# EasyEDA schematic SCH_Amiga-KickSmash-32-in-system-flash_2025-04-10.json

## Sheets
1 STM32: TITLE: STM32; REV: 7.1; Date: 2025-03-13; Sheet: 1/4; Drawn By: cdhooper; Company: eebugs.com
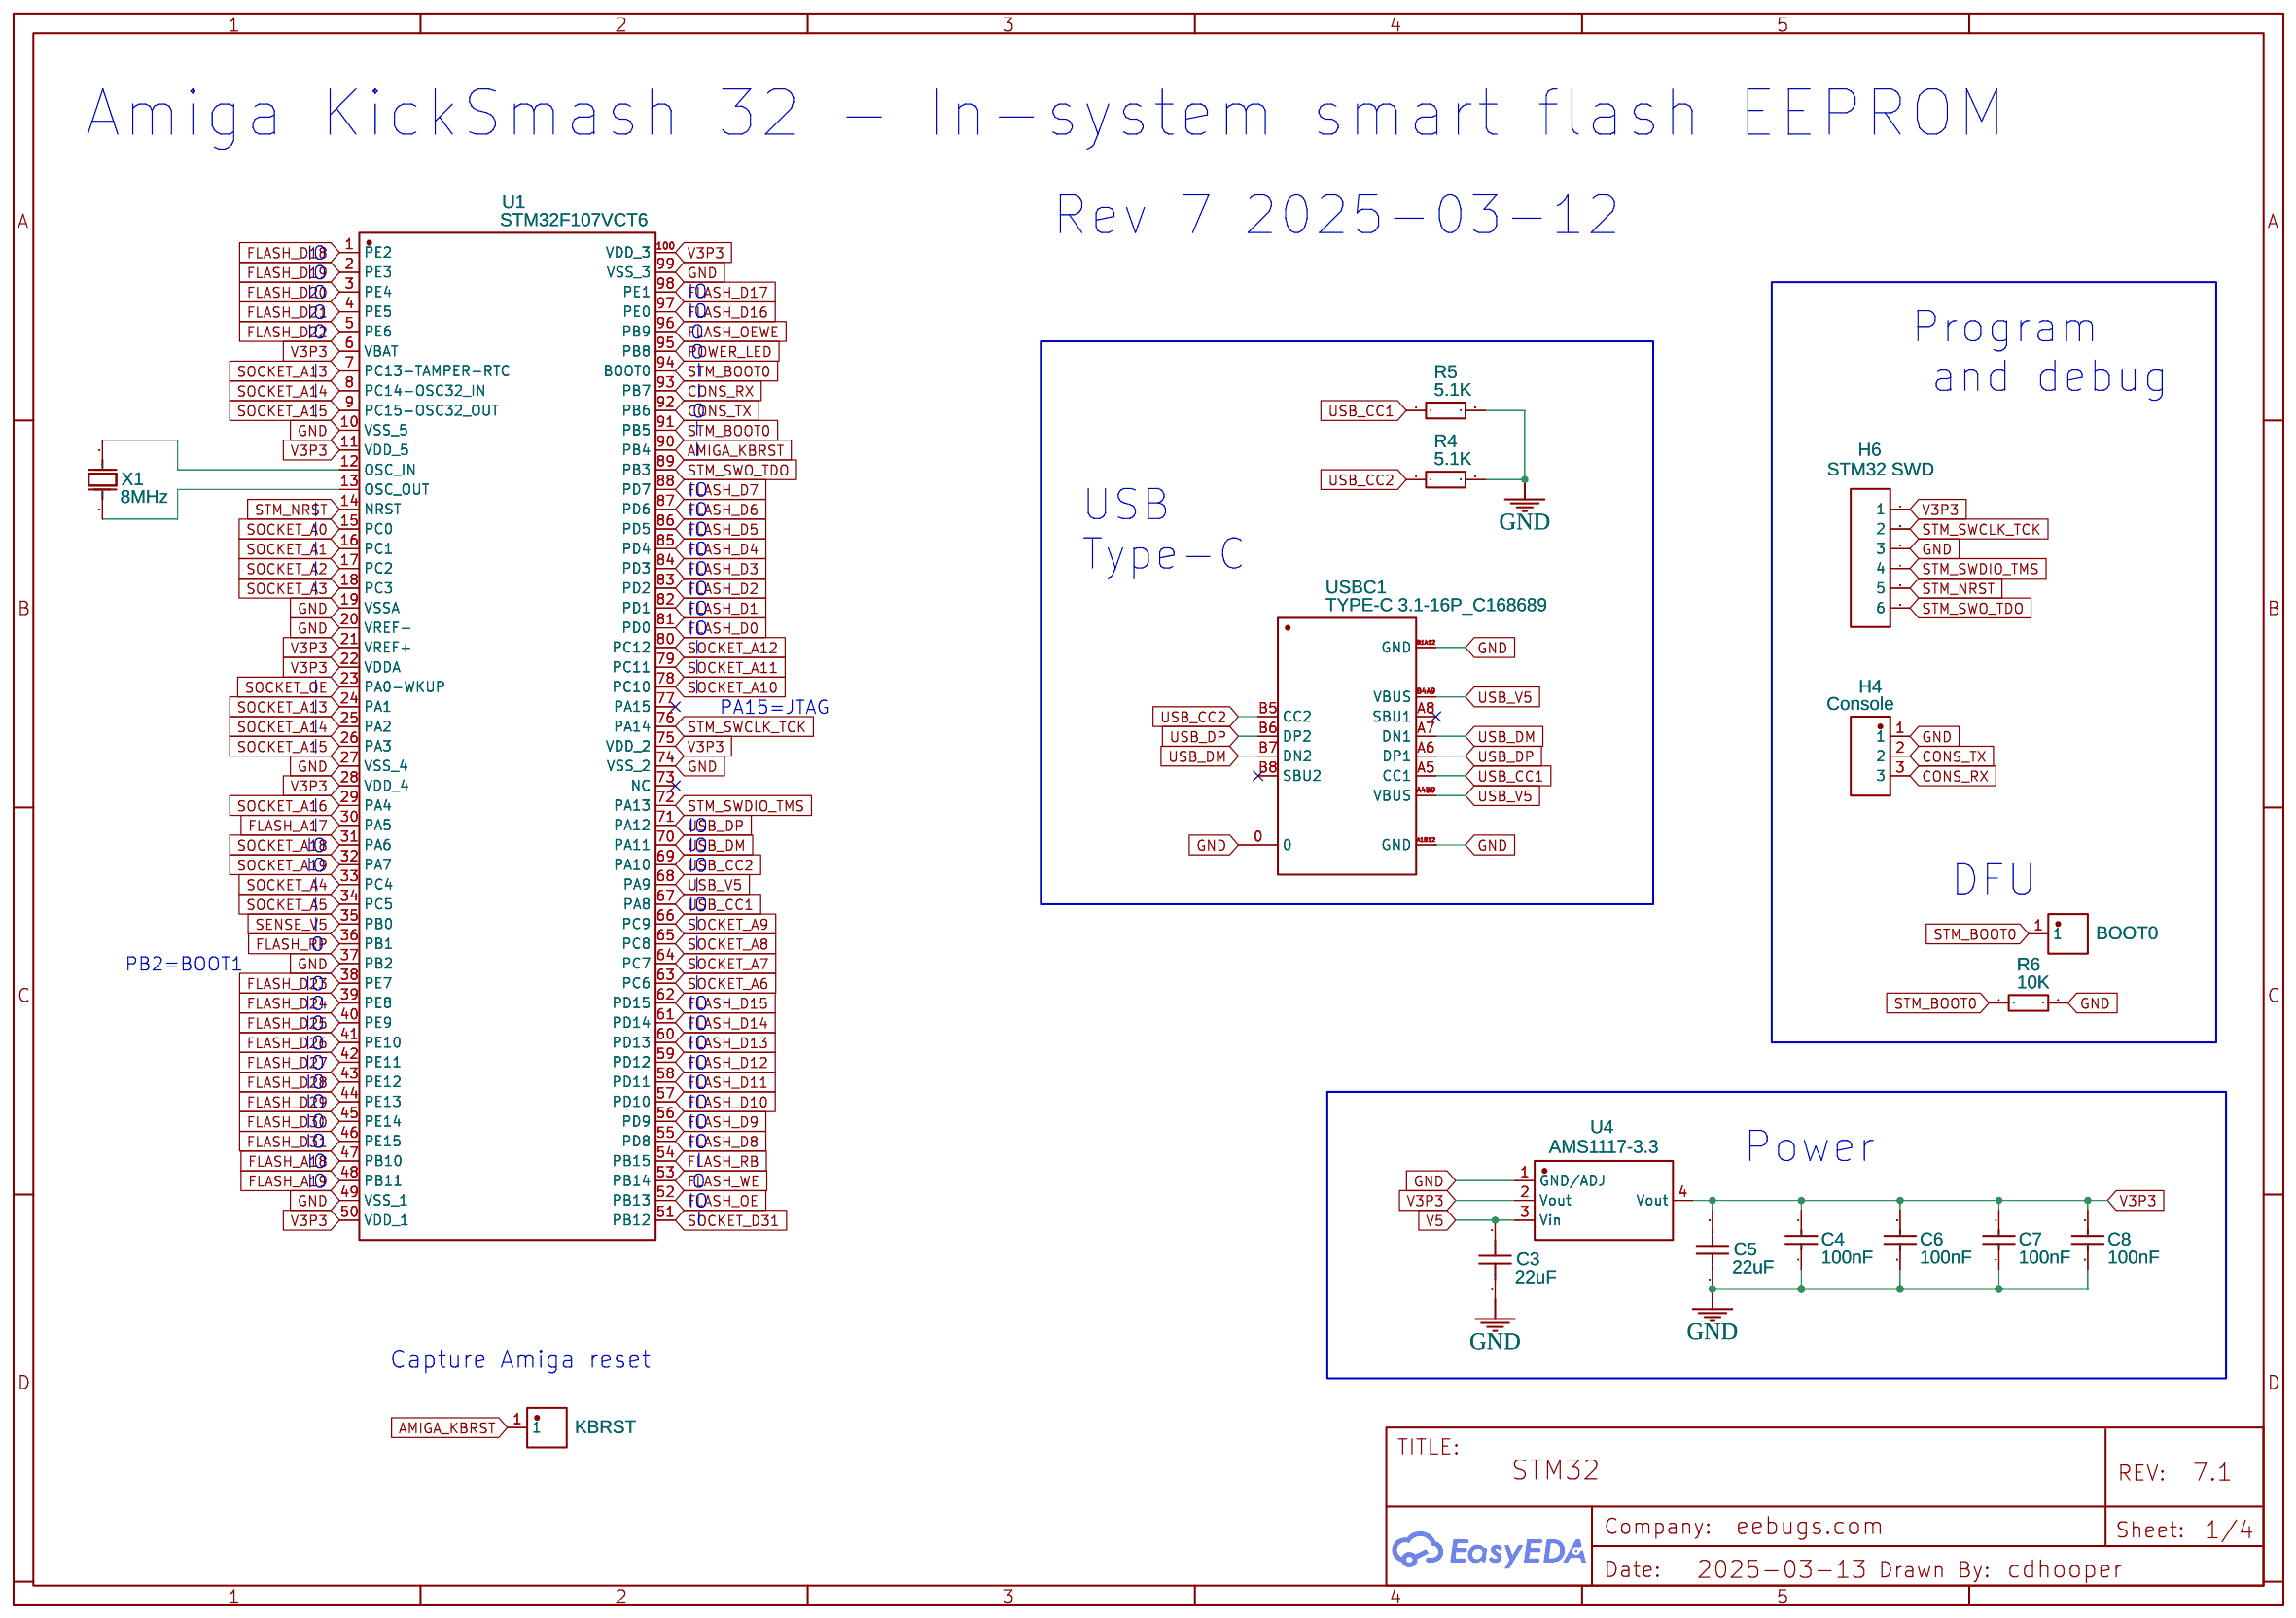
[diagram p0: STM32]
2 Flash: TITLE: Flash + Sockets; Sheet: 2/4
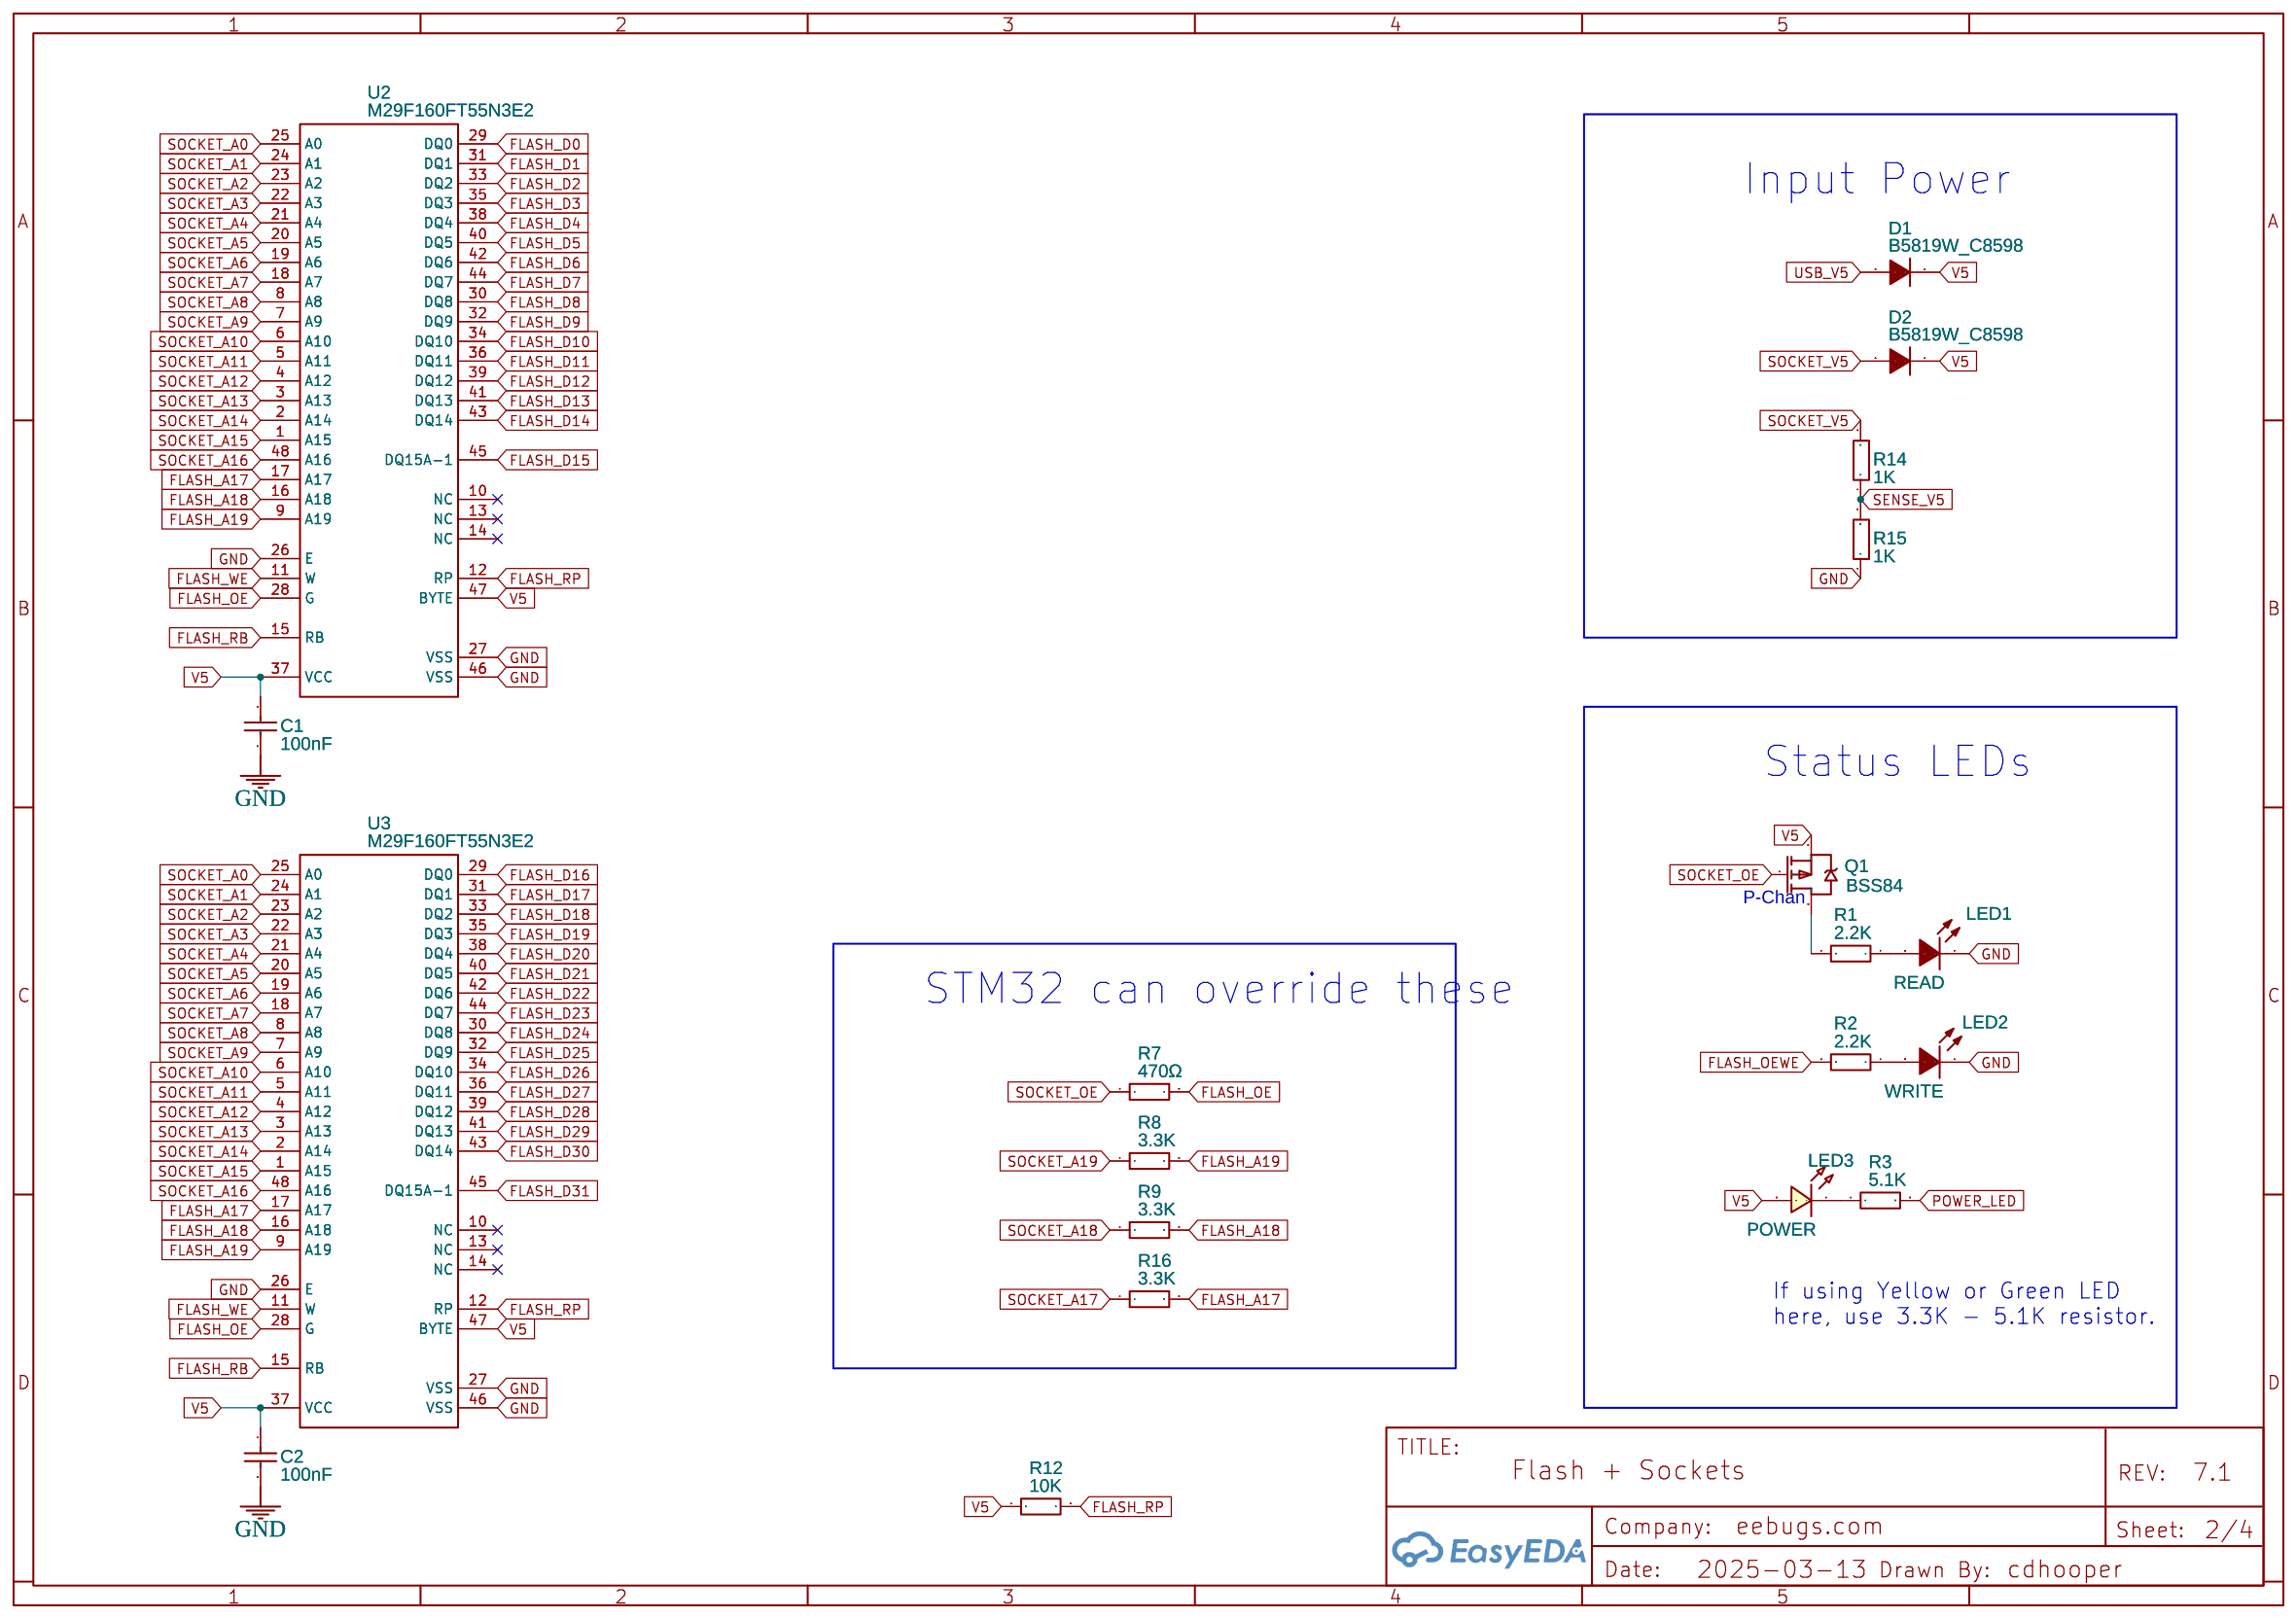
[diagram p1: Flash]
3 Sockets: TITLE: Sockets; Sheet: 3/4
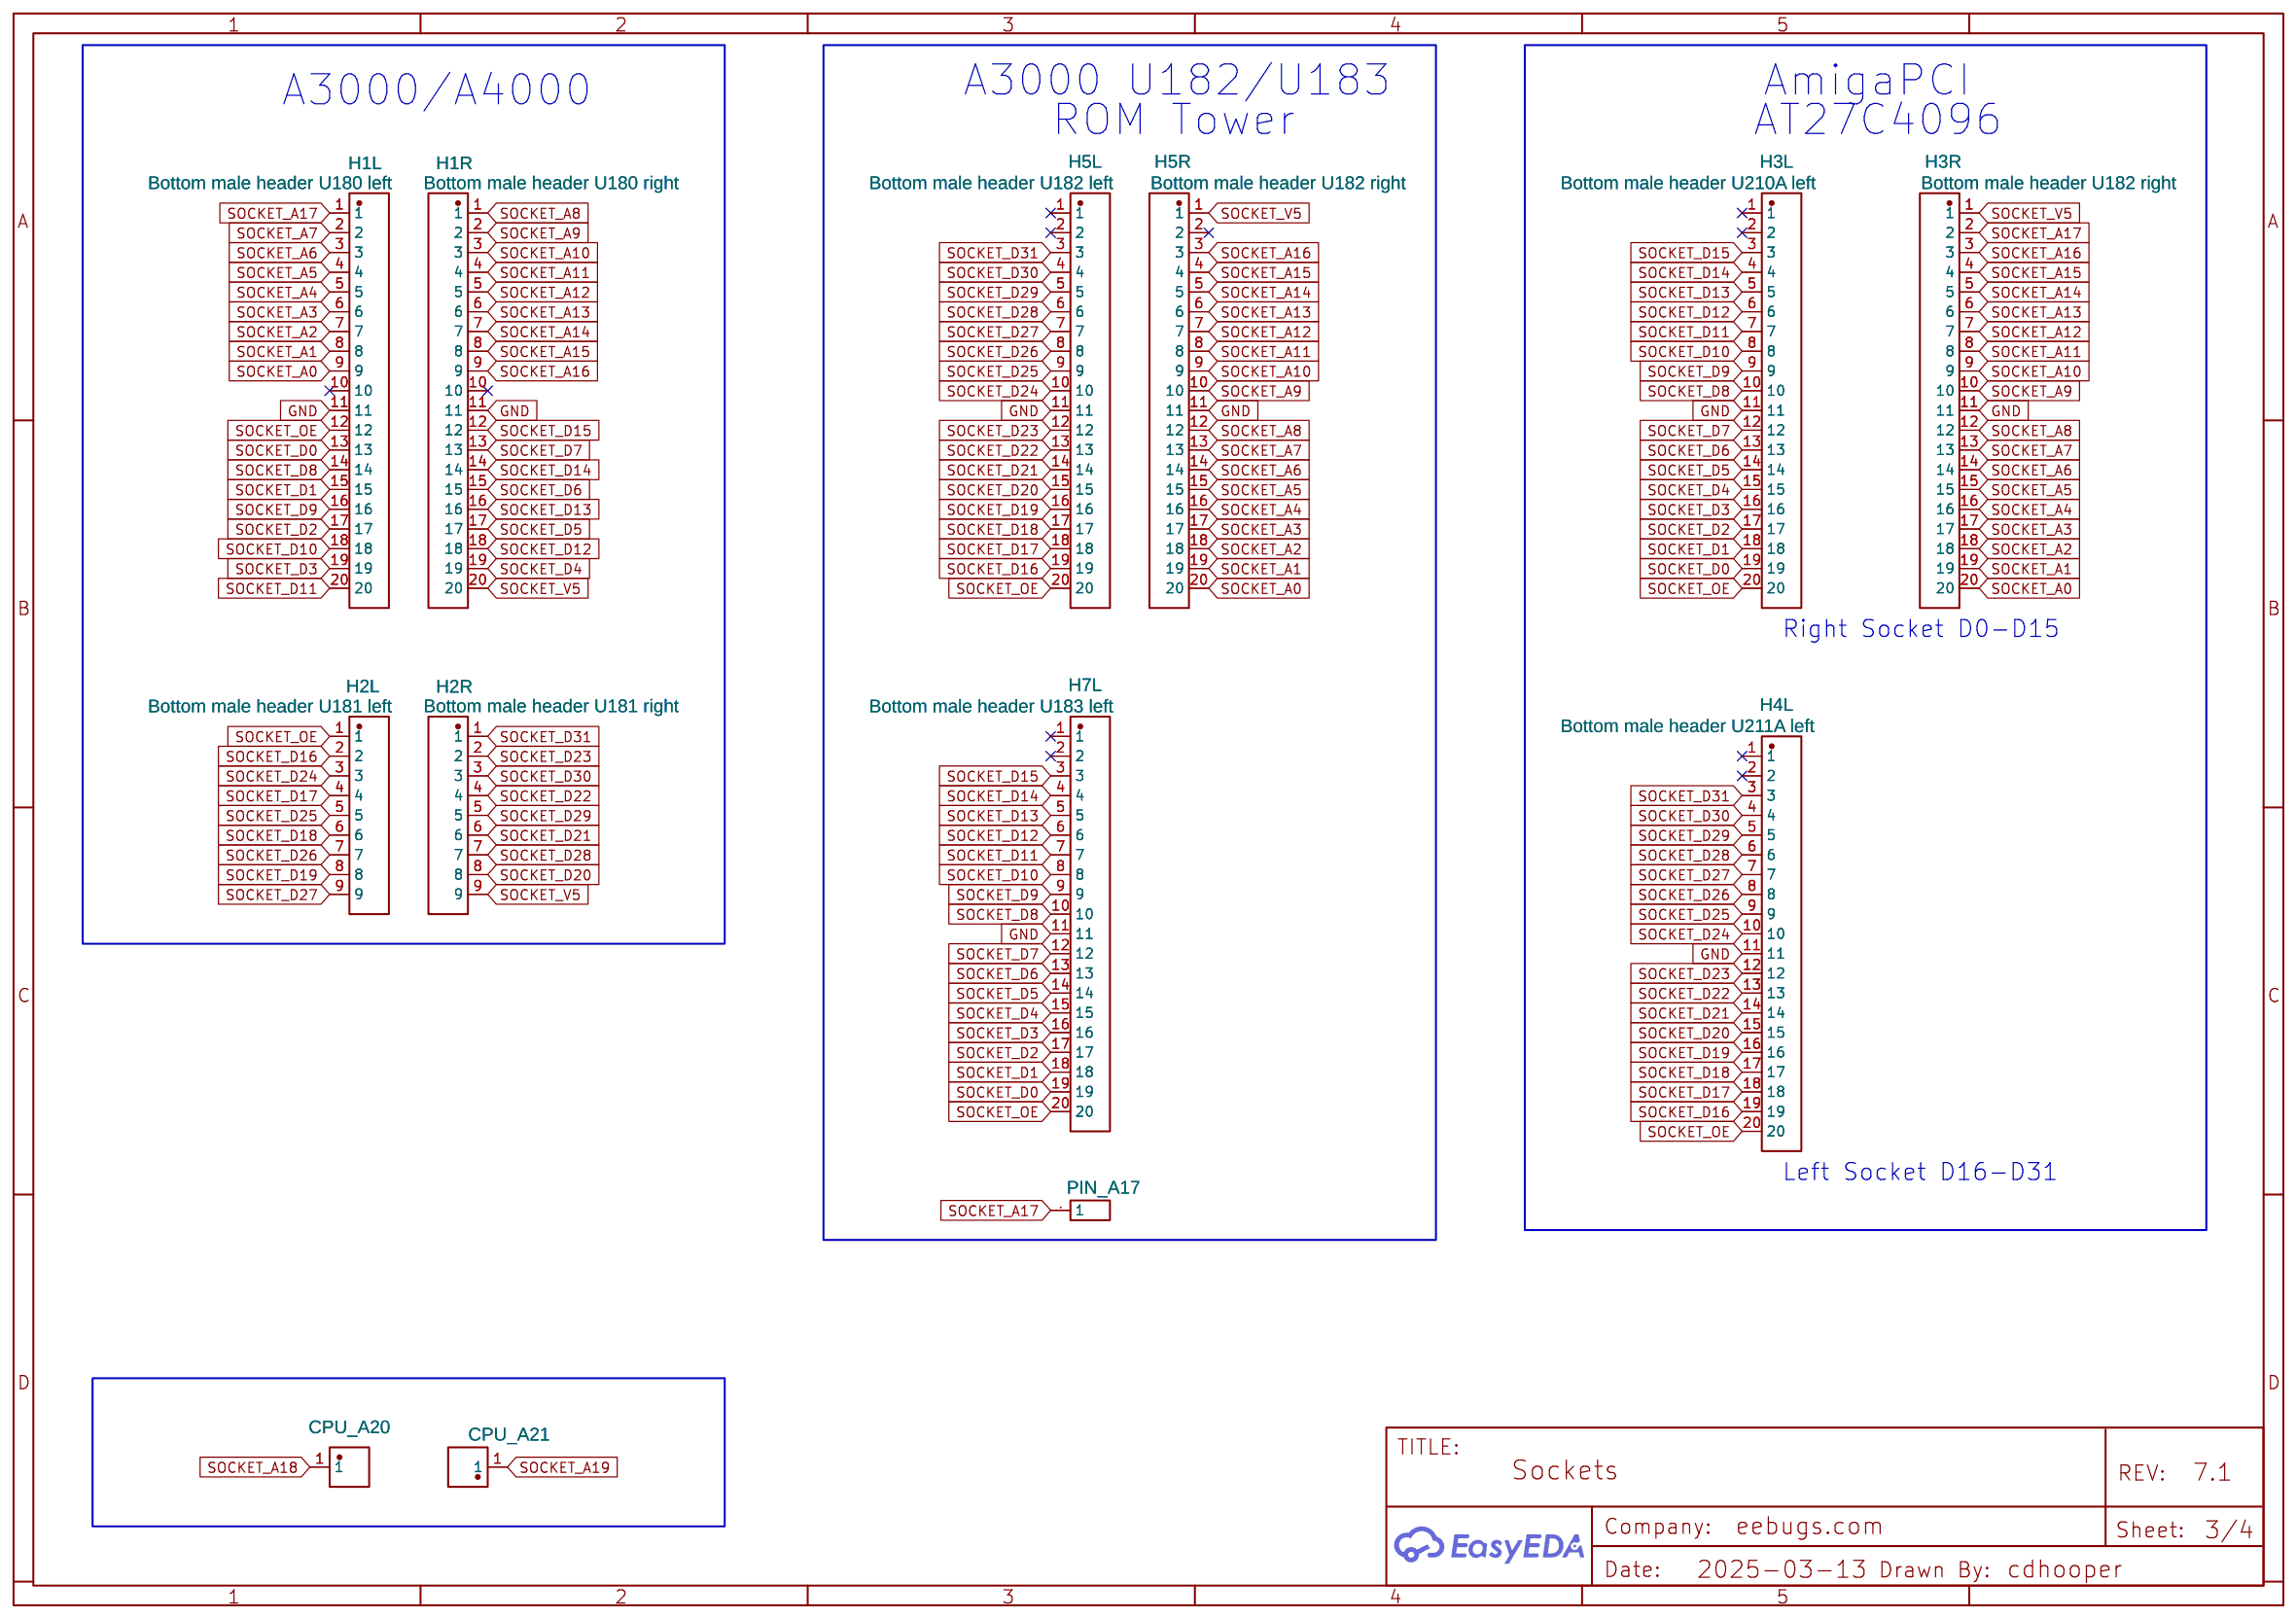
[diagram p2: Sockets]
4 Buffer: TITLE: Buffer; Sheet: 4/4
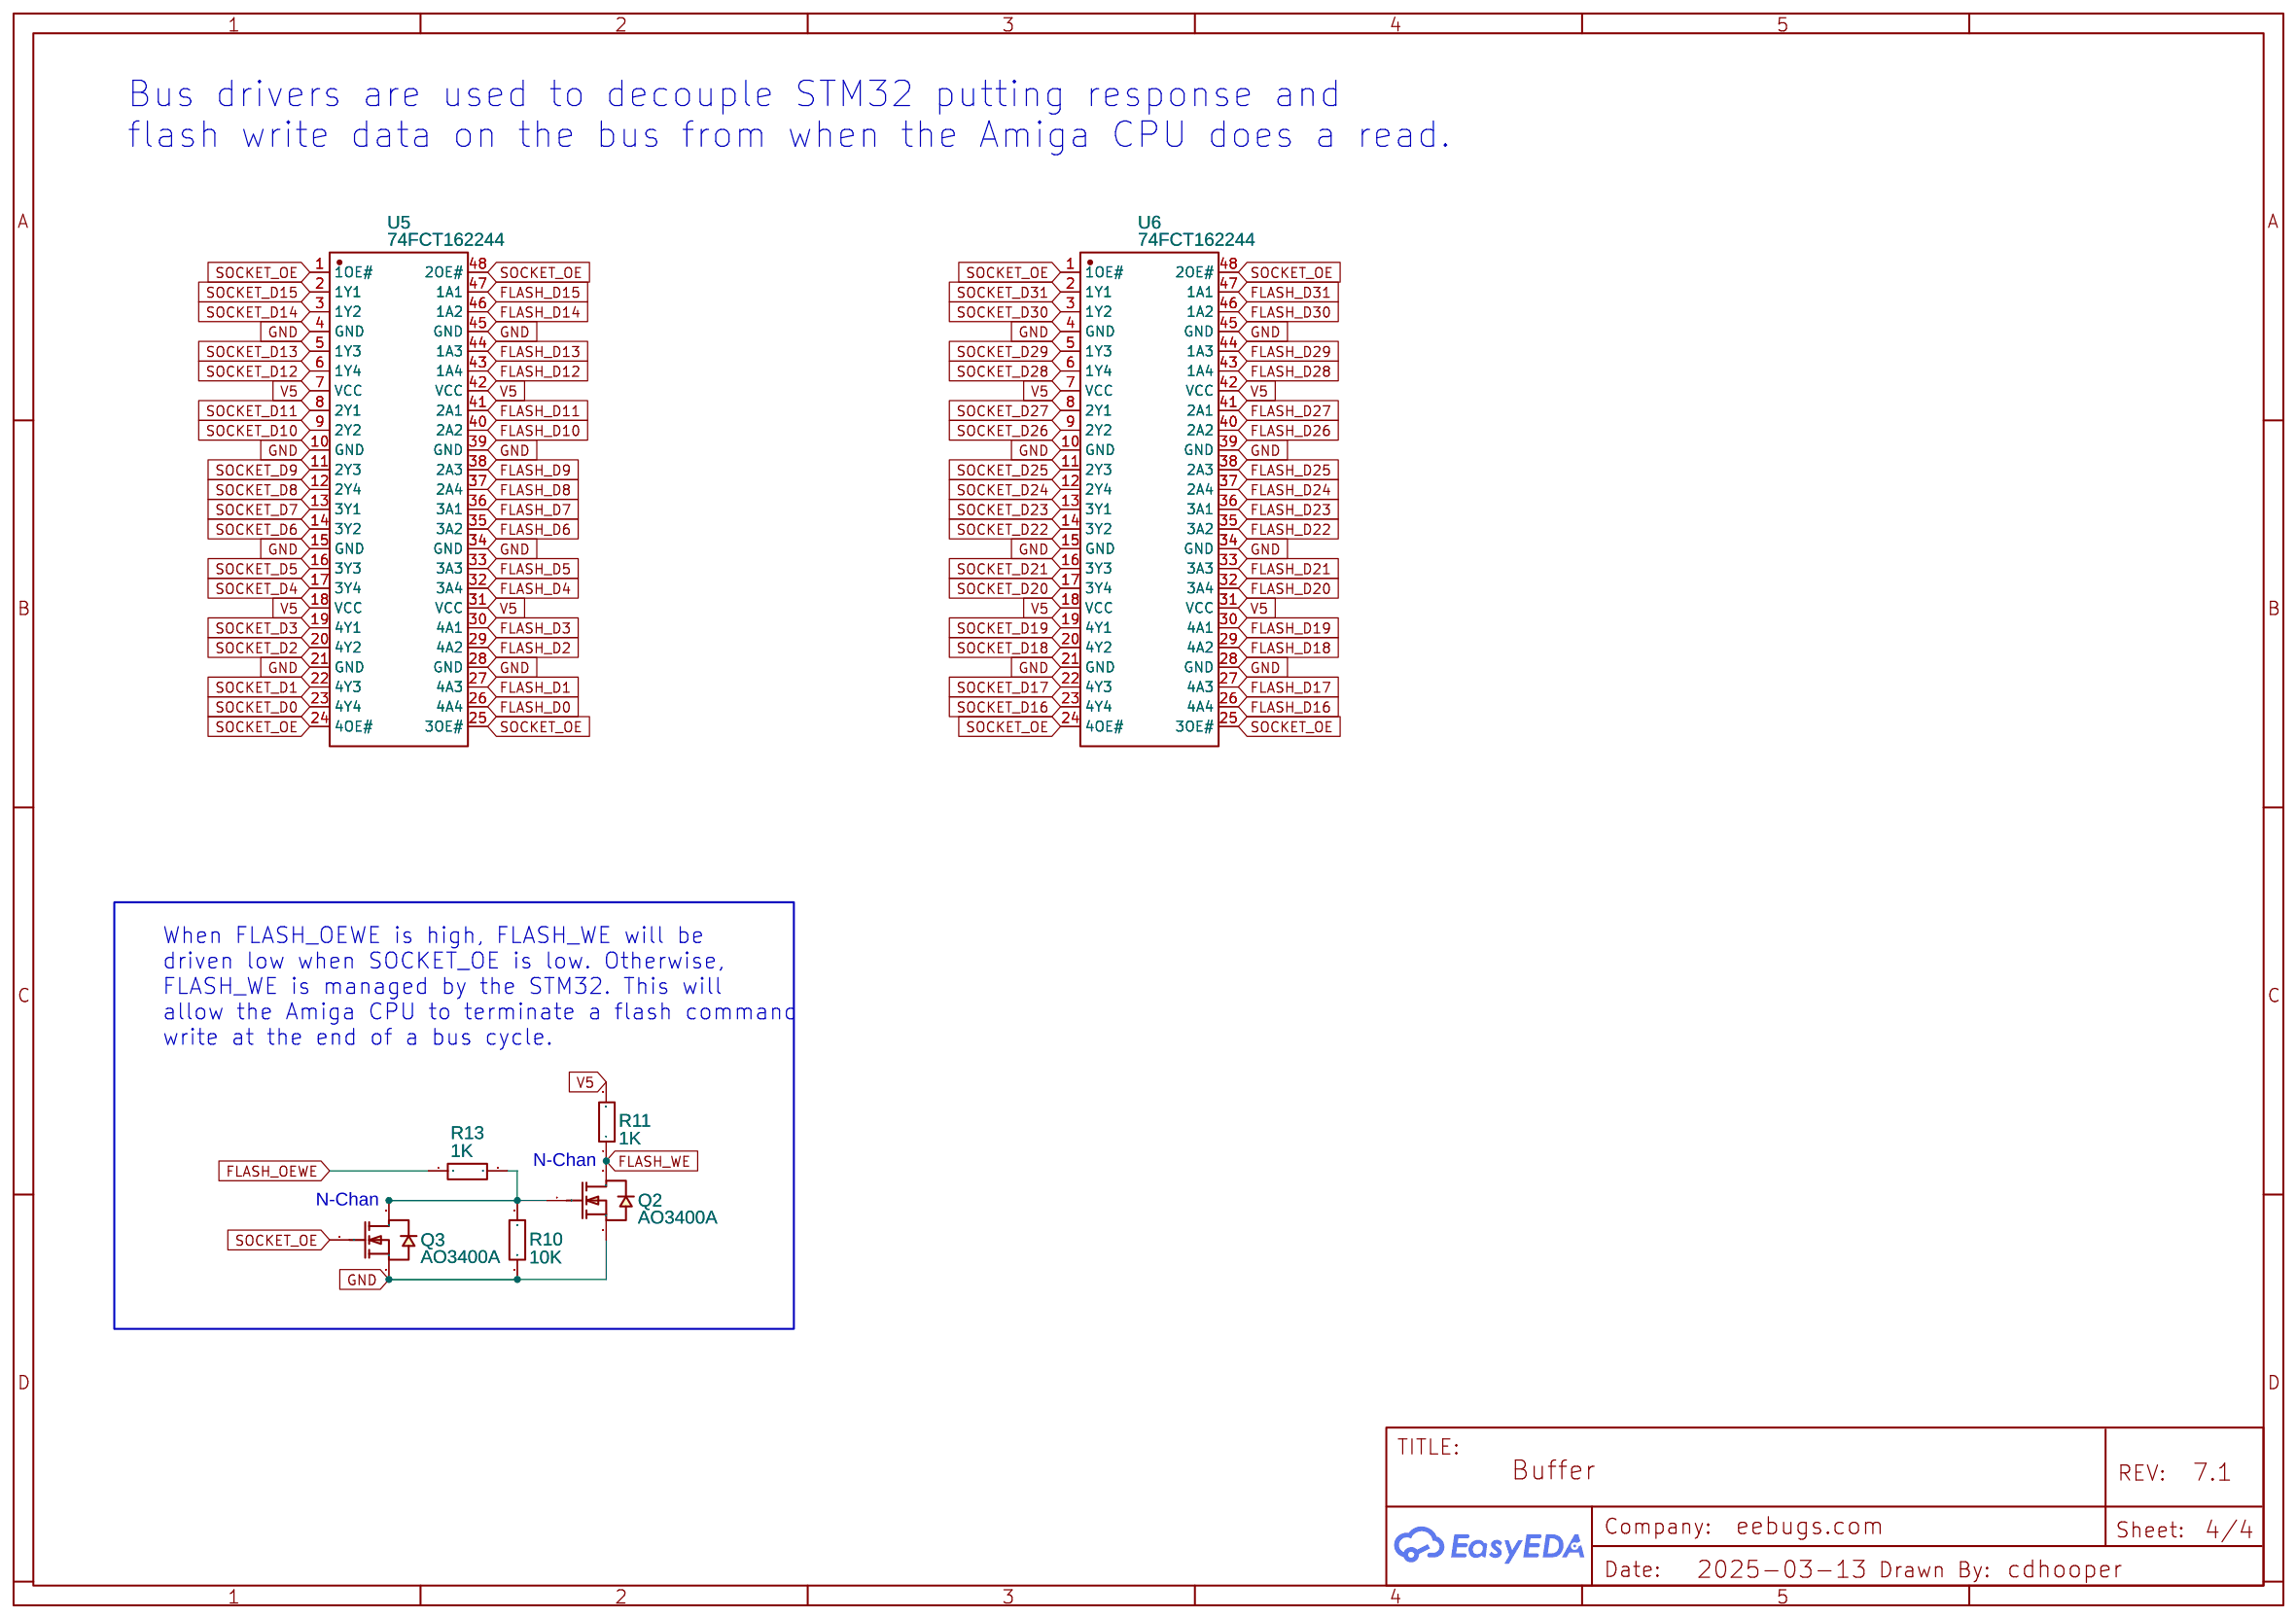
[diagram p3: Buffer]

## Parts
sheet Buffer
Q2  AO3400A  [SOT-23-3_L2.9-W1.6-P1.90-LS2.8-BR]
Q3  AO3400A  [SOT-23-3_L2.9-W1.6-P1.90-LS2.8-BR]
R10  10K  [R0805]
R11  1K  [0805]
R13  1K  [0805]
U5  74FCT162244  [TSSOP-48_L12.6-W6.2-P0.50-LS8.1-BL]
U6  74FCT162244  [TSSOP-48_L12.6-W6.2-P0.50-LS8.1-BL]
sheet Flash
C1  100nF  [C0805]
C2  100nF  [C0805]
D1  B5819W_C8598  [SOD-123_L2.8-W1.8-LS3.7-RD]
D2  B5819W_C8598  [SOD-123_L2.8-W1.8-LS3.7-RD]
LED1  READ  [LED0805-RD]
LED2  WRITE  [LED0805-RD]
LED3  POWER  [LED0805-RD_PURPLE]
Q1  BSS84  [SOT-23(SOT-23-3)]
R1  2.2K  [R0805]
R2  2.2K  [R0805]
R3  5.1K  [R0805]
R7  470Ω  [R0805]
R8  3.3K  [R0805]
R9  3.3K  [R0805]
R12  10K  [R0805]
R14  1K  [0805]
R15  1K  [0805]
R16  3.3K  [R0805]
U2  M29F160FT55N3E2  [MICT-N-48]
U3  M29F160FT55N3E2  [MICT-N-48]
sheet Sockets
H1L  Bottom male header U180 left  [HDR-TH_20P-P2.54-1.7-0.95]
H1R  Bottom male header U180 right  [HDR-TH_20P-P2.54-1.7-0.95]
H2L  Bottom male header U181 left  [HDR-M-2.54_1X9_1.7_0.95]
H2R  Bottom male header U181 right  [HDR-M-2.54_1X9_1.7_0.95]
H3L  Bottom male header U210A left  [HDR-TH_20P-P2.54-1.7-0.95]
H3R  Bottom male header U182 right  [HDR-TH_20P-P2.54-1.7-0.95]
H4L  Bottom male header U211A left  [HDR-TH_20P-P2.54-1.7-0.95]
H5L  Bottom male header U182 left  [HDR-TH_20P-P2.54-1.7-0.95]
H5R  Bottom male header U182 right  [HDR-TH_20P-P2.54-1.7-0.95]
H7  CPU_A20  [HDR-TH_1P-P2.54-H-M-W7.7-P-BOT-SILK]
H7L  Bottom male header U183 left  [HDR-TH_20P-P2.54-1.7-0.95]
H8  CPU_A21  [HDR-TH_1P-P2.54-H-M-W7.7-P-BOT-SILK]
H9  PIN_A17  [HDR-TH_1P-P2.54-V-M]
sheet STM32
C3  22uF  [C0805]
C4  100nF  [C0805]
C5  22uF  [C0805]
C6  100nF  [C0805]
C7  100nF  [C0805]
C8  100nF  [C0805]
H3  KBRST  [HDR-TH_1P-P2.54-H-M-W7.7-P-BOT-SILK]
H4  Console  [HDR-TH_3P-P2.54-H-M-W10.4]
H5  BOOT0  [HDR-TH_1P-P2.54-H-M-W7.7-P-BOT-SILK]
H6  STM32 SWD  [HDR-6X1/2.54]
R4  5.1K  [R0805]
R5  5.1K  [R0805]
R6  10K  [R0805]
U1  STM32F107VCT6  [LQFP-100_L14.0-W14.0-P0.50-LS16.0-BL]
U4  AMS1117-3.3  [SOT-223-3_L6.5-W3.4-P2.30-LS7.0-BR]
USBC1  TYPE-C 3.1-16P_C168689  [USB-C-SMD_TYPE-C-USB-12-NO-CUTOUT]
X1  8MHz  [OSC-SMD_L5.0-W3.2]

## Library data of the parts
Q2 Q3 = AO3400A: Supplier: LCSC; Manufacturer: AOS; Supplier Part: C20917; JLCPCB Part Class: Basic Part; link: https://lcsc.com/eda_search?q=C20917&%26type=1&ref=editor
R6 R10 R12 = 0805W8F1002T5E: Supplier: LCSC; Manufacturer: UniOhm; LCSC Assembly: Yes; Supplier Part: C17414; SMT Type: Basic
R11 R13-R15 = 0805W8F1001T5E: Supplier: LCSC; Manufacturer: UniOhm; LCSC Assembly: Yes; Supplier Part: C17513; SMT Type: Basic; Mounted: No
U5 U6 = 74FCT162244CTPAG: Contributor: LCSC; Supplier: LCSC; Supplier Part: C1548694; Manufacturer: RENESAS(瑞萨)/IDT; JLCPCB Part Class: Extended Part; link: https://lcsc.com/eda_search?q=C1548694&%26type=1&ref=editor
C1 C2 C4 C6-C8 = CC0805KRX7R9BB104: Supplier: LCSC; Manufacturer: YAGEO; Supplier Part: C49678; JLCPCB Part Class: Basic Part
D1 D2 = B5819W_C8598: Supplier: LCSC; Manufacturer: CJ; Manufacturer Part: B5819W; Supplier Part: C8598; JLCPCB Part Class: Basic Part
LED1 = 17-21SUYC/TR8: Supplier: LCSC; Manufacturer: KENTO; LCSC Assembly: Yes; image: //image.lceda.cn/szlcsc/C2296.jpg; Supplier Part: C2296; SMT Type: Basic
LED2 = 0805G (Green): Supplier: LCSC; Manufacturer: KENTO; LCSC Assembly: Yes; image: //image.lceda.cn/szlcsc/C2297.jpg; Supplier Part: C2297; SMT Type: Basic
LED3 = P2-0805UVTCS2-0.8T: Contributor: LCSC; Supplier: LCSC; Supplier Part: C2827270; Manufacturer: TUOZHAN(拓展光电); JLCPCB Part Class: Extended Part
Q1 = -: Supplier: LCSC; Manufacturer: LRC; Manufacturer Part: LBSS84LT1G; LCSC Assembly: Yes; image: //image.lceda.cn/szlcsc/C8492.jpg; Supplier Part: C8492; SMT Type: Basic
R1 R2 = 0805W8F2201T5E: Supplier: LCSC; Manufacturer: UniOhm; LCSC Assembly: Yes; Supplier Part: C17520; SMT Type: Basic
R3-R5 = 0805W8F5101T5E: Supplier: LCSC; Manufacturer: UniOhm; LCSC Assembly: Yes; Supplier Part: C27834; SMT Type: Basic
R7 = 0805W8F4700T5E: Supplier: LCSC; Manufacturer: UNI-ROYAL(厚声); Supplier Part: C17710; JLCPCB Part Class: Basic Part
R8 R9 R16 = 0805W8F3301T5E: Supplier: LCSC; Manufacturer: UNI-ROYAL(厚声); Supplier Part: C26010; JLCPCB Part Class: Basic Part
U2 U3 = M29F160FT55N3E2: 16 Mb (x8x16) Automotive Parallel NOR Flash Memory, 55 ns, 4.5 to 5.5 V, 48-pin TSOP (N), Tray
H1L H1R = PZ254-1-20-Z-C: Contributor: lcsc; Supplier: LCSC; Supplier Part: C5156447; Manufacturer: HCTL(华灿天禄); JLCPCB Part Class: Extended Part
H2L = PZ254-1-09-Z-C: Contributor: lcsc; Supplier: LCSC; Supplier Part: C5156436; Manufacturer: HCTL(华灿天禄); JLCPCB Part Class: Extended Part
H2R = PZ254-1-09-Z-C: Contributor: lcsc; Supplier: LCSC; Supplier Part: C5156436; Manufacturer: HCTL(华灿天禄); JLCPCB Part Class: Extended Part; Package Display: No
H3L H3R H4L H5L H5R H7L = Header-Male-2.54_1x20: Supplier: LCSC; Manufacturer: BOOMELE; Manufacturer Part: 2.54mm 1*20PHeader; Supplier Part: C50981; JLCPCB Part Class: Extended Part
H3 H5 H7 H8 = X6511WR-01H-C30D60R2: Contributor: LCSC; Supplier: LCSC; Supplier Part: C2883838; Manufacturer: XKB Connection(中国星坤); Manufacturer Part: X6511WR-01H-C60D30R2; JLCPCB Part Class: Extended Part
H9 = Header-Male-2.54_1x1: Supplier: LCSC; Manufacturer: ReliaPro; Supplier Part: C81276; LCSC Assembly: Yes; SMT Type: Extend; Mounted: No
C3 C5 = CL21A226MAQNNNE: Supplier: LCSC; Manufacturer: SAMSUNG; LCSC Assembly: Yes; Supplier Part: C45783; SMT Type: Basic
H4 = PZ254R-11-03P: Contributor: LCSC; Supplier: LCSC; Supplier Part: C492411; Manufacturer: XFCN(兴飞); JLCPCB Part Class: Extended Part
H6 = -: Supplier: LCSC; Manufacturer: BOOMELE; Manufacturer Part: Female header 1*6p; Supplier Part: C40877; Mounted: No
U1 = STM32F107VCT6: Supplier: LCSC; Manufacturer: STMicroelectronics; LCSC Assembly: Yes; image: //image.lceda.cn/szlcsc/C8315.jpg; Supplier Part: C8315; SMT Type: Basic; subpart_no: 1
U4 = AMS1117-3.3: sourceId: dwIGgezVh; Supplier: LCSC; Manufacturer: AMS; LCSC Assembly: Yes; image: //image.lceda.cn/szlcsc/C6186.jpg; Supplier Part: C6186; SMT Type: Basic
USBC1 = TYPE-C 3.1-16P_C168689: Supplier: LCSC; Supplier Part: C168689; Manufacturer: LCSC; Contributor: 立创EDA官方封装库; JLCPCB Part Class: Extended Part
X1 = X50328MSB2GI: Supplier: LCSC; Manufacturer: YXC; LCSC Assembly: Yes; Supplier Part: C115962; SMT Type: Basic

## Nets
GND: C1.2 C2.2 C3.1 C4.2 C5.1 C6.2 C7.2 C8.2 H1L.11 H1R.11 H3L.11 H3R.11 H4.1 H4L.11 H5L.11 H5R.11 H6.3 H7L.11 LED1.1(-) LED2.1(K) Q2.2(S) Q3.2(S) R4.2 R5.2 R6.2 R10.2 R15.1 U1.10(VSS_5) U1.19(VSSA) U1.20(VREF-) U1.27(VSS_4) U1.37(PB2) U1.49(VSS_1) U1.74(VSS_2) U1.99(VSS_3) U2.26(E) U2.27(VSS) U2.46(VSS) U3.26(E) U3.27(VSS) U3.46(VSS) U4.1(GND/ADJ) U5.4(GND) U5.10(GND) U5.15(GND) U5.21(GND) U5.28(GND) U5.34(GND) U5.39(GND) U5.45(GND) U6.4(GND) U6.10(GND) U6.15(GND) U6.21(GND) U6.28(GND) U6.34(GND) U6.39(GND) U6.45(GND) USBC1.0 USBC1.A1B12(GND) USBC1.B1A12(GND)
V3P3: C4.1 C5.2 C6.1 C7.1 C8.1 H6.1 U1.6(VBAT) U1.11(VDD_5) U1.21(VREF+) U1.22(VDDA) U1.28(VDD_4) U1.50(VDD_1) U1.75(VDD_2) U1.100(VDD_3) U4.2(Vout) U4.4(Vout)
V5: C1.1 C2.1 C3.2 D1.1(-) D2.1(-) LED3.2(+) Q1.2(S) R11.2 R12.1 U2.37(VCC) U2.47(BYTE) U3.37(VCC) U3.47(BYTE) U4.3(Vin) U5.7(VCC) U5.18(VCC) U5.31(VCC) U5.42(VCC) U6.7(VCC) U6.18(VCC) U6.31(VCC) U6.42(VCC)
AMIGA_KBRST: H3.1 U1.90(PB4)
CONS_RX: H4.3 U1.93(PB7)
CONS_TX: H4.2 U1.92(PB6)
FLASH_A17: R16.2 U1.30(PA5) U2.17(A17) U3.17(A17)
FLASH_A18: R9.2 U1.47(PB10) U2.16(A18) U3.16(A18)
FLASH_A19: R8.2 U1.48(PB11) U2.9(A19) U3.9(A19)
FLASH_D0: U1.81(PD0) U2.29(DQ0) U5.26(4A4)
FLASH_D1: U1.82(PD1) U2.31(DQ1) U5.27(4A3)
FLASH_D2: U1.83(PD2) U2.33(DQ2) U5.29(4A2)
FLASH_D3: U1.84(PD3) U2.35(DQ3) U5.30(4A1)
FLASH_D4: U1.85(PD4) U2.38(DQ4) U5.32(3A4)
FLASH_D5: U1.86(PD5) U2.40(DQ5) U5.33(3A3)
FLASH_D6: U1.87(PD6) U2.42(DQ6) U5.35(3A2)
FLASH_D7: U1.88(PD7) U2.44(DQ7) U5.36(3A1)
FLASH_D8: U1.55(PD8) U2.30(DQ8) U5.37(2A4)
FLASH_D9: U1.56(PD9) U2.32(DQ9) U5.38(2A3)
FLASH_D10: U1.57(PD10) U2.34(DQ10) U5.40(2A2)
FLASH_D11: U1.58(PD11) U2.36(DQ11) U5.41(2A1)
FLASH_D12: U1.59(PD12) U2.39(DQ12) U5.43(1A4)
FLASH_D13: U1.60(PD13) U2.41(DQ13) U5.44(1A3)
FLASH_D14: U1.61(PD14) U2.43(DQ14) U5.46(1A2)
FLASH_D15: U1.62(PD15) U2.45(DQ15A-1) U5.47(1A1)
FLASH_D16: U1.97(PE0) U3.29(DQ0) U6.26(4A4)
FLASH_D17: U1.98(PE1) U3.31(DQ1) U6.27(4A3)
FLASH_D18: U1.1(PE2) U3.33(DQ2) U6.29(4A2)
FLASH_D19: U1.2(PE3) U3.35(DQ3) U6.30(4A1)
FLASH_D20: U1.3(PE4) U3.38(DQ4) U6.32(3A4)
FLASH_D21: U1.4(PE5) U3.40(DQ5) U6.33(3A3)
FLASH_D22: U1.5(PE6) U3.42(DQ6) U6.35(3A2)
FLASH_D23: U1.38(PE7) U3.44(DQ7) U6.36(3A1)
FLASH_D24: U1.39(PE8) U3.30(DQ8) U6.37(2A4)
FLASH_D25: U1.40(PE9) U3.32(DQ9) U6.38(2A3)
FLASH_D26: U1.41(PE10) U3.34(DQ10) U6.40(2A2)
FLASH_D27: U1.42(PE11) U3.36(DQ11) U6.41(2A1)
FLASH_D28: U1.43(PE12) U3.39(DQ12) U6.43(1A4)
FLASH_D29: U1.44(PE13) U3.41(DQ13) U6.44(1A3)
FLASH_D30: U1.45(PE14) U3.43(DQ14) U6.46(1A2)
FLASH_D31: U1.46(PE15) U3.45(DQ15A-1) U6.47(1A1)
FLASH_OE: R7.2 U1.52(PB13) U2.28(G) U3.28(G)
FLASH_OEWE: R2.2 R13.1 U1.96(PB9)
FLASH_RB: U1.54(PB15) U2.15(RB) U3.15(RB)
FLASH_RP: R12.2 U1.36(PB1) U2.12(RP) U3.12(RP)
FLASH_WE: Q2.3(D) R11.1 U1.53(PB14) U2.11(W) U3.11(W)
POWER_LED: R3.2 U1.95(PB8)
SENSE_V5: R14.1 R15.2 U1.35(PB0)
SOCKET_A0: H1L.9 H3R.20 H5R.20 U1.15(PC0) U2.25(A0) U3.25(A0)
SOCKET_A1: H1L.8 H3R.19 H5R.19 U1.16(PC1) U2.24(A1) U3.24(A1)
SOCKET_A2: H1L.7 H3R.18 H5R.18 U1.17(PC2) U2.23(A2) U3.23(A2)
SOCKET_A3: H1L.6 H3R.17 H5R.17 U1.18(PC3) U2.22(A3) U3.22(A3)
SOCKET_A4: H1L.5 H3R.16 H5R.16 U1.33(PC4) U2.21(A4) U3.21(A4)
SOCKET_A5: H1L.4 H3R.15 H5R.15 U1.34(PC5) U2.20(A5) U3.20(A5)
SOCKET_A6: H1L.3 H3R.14 H5R.14 U1.63(PC6) U2.19(A6) U3.19(A6)
SOCKET_A7: H1L.2 H3R.13 H5R.13 U1.64(PC7) U2.18(A7) U3.18(A7)
SOCKET_A8: H1R.1 H3R.12 H5R.12 U1.65(PC8) U2.8(A8) U3.8(A8)
SOCKET_A9: H1R.2 H3R.10 H5R.10 U1.66(PC9) U2.7(A9) U3.7(A9)
SOCKET_A10: H1R.3 H3R.9 H5R.9 U1.78(PC10) U2.6(A10) U3.6(A10)
SOCKET_A11: H1R.4 H3R.8 H5R.8 U1.79(PC11) U2.5(A11) U3.5(A11)
SOCKET_A12: H1R.5 H3R.7 H5R.7 U1.80(PC12) U2.4(A12) U3.4(A12)
SOCKET_A13: H1R.6 H3R.6 H5R.6 U1.7(PC13-TAMPER-RTC) U1.24(PA1) U2.3(A13) U3.3(A13)
SOCKET_A14: H1R.7 H3R.5 H5R.5 U1.8(PC14-OSC32_IN) U1.25(PA2) U2.2(A14) U3.2(A14)
SOCKET_A15: H1R.8 H3R.4 H5R.4 U1.9(PC15-OSC32_OUT) U1.26(PA3) U2.1(A15) U3.1(A15)
SOCKET_A16: H1R.9 H3R.3 H5R.3 U1.29(PA4) U2.48(A16) U3.48(A16)
SOCKET_A17: H1L.1 H3R.2 H9.1 R16.1
SOCKET_A18: H7.1 R9.1 U1.31(PA6)
SOCKET_A19: H8.1 R8.1 U1.32(PA7)
SOCKET_D0: H1L.13 H3L.19 H7L.19 U5.23(4Y4)
SOCKET_D1: H1L.15 H3L.18 H7L.18 U5.22(4Y3)
SOCKET_D2: H1L.17 H3L.17 H7L.17 U5.20(4Y2)
SOCKET_D3: H1L.19 H3L.16 H7L.16 U5.19(4Y1)
SOCKET_D4: H1R.19 H3L.15 H7L.15 U5.17(3Y4)
SOCKET_D5: H1R.17 H3L.14 H7L.14 U5.16(3Y3)
SOCKET_D6: H1R.15 H3L.13 H7L.13 U5.14(3Y2)
SOCKET_D7: H1R.13 H3L.12 H7L.12 U5.13(3Y1)
SOCKET_D8: H1L.14 H3L.10 H7L.10 U5.12(2Y4)
SOCKET_D9: H1L.16 H3L.9 H7L.9 U5.11(2Y3)
SOCKET_D10: H1L.18 H3L.8 H7L.8 U5.9(2Y2)
SOCKET_D11: H1L.20 H3L.7 H7L.7 U5.8(2Y1)
SOCKET_D12: H1R.18 H3L.6 H7L.6 U5.6(1Y4)
SOCKET_D13: H1R.16 H3L.5 H7L.5 U5.5(1Y3)
SOCKET_D14: H1R.14 H3L.4 H7L.4 U5.3(1Y2)
SOCKET_D15: H1R.12 H3L.3 H7L.3 U5.2(1Y1)
SOCKET_D16: H2L.2 H4L.19 H5L.19 U6.23(4Y4)
SOCKET_D17: H2L.4 H4L.18 H5L.18 U6.22(4Y3)
SOCKET_D18: H2L.6 H4L.17 H5L.17 U6.20(4Y2)
SOCKET_D19: H2L.8 H4L.16 H5L.16 U6.19(4Y1)
SOCKET_D20: H2R.8 H4L.15 H5L.15 U6.17(3Y4)
SOCKET_D21: H2R.6 H4L.14 H5L.14 U6.16(3Y3)
SOCKET_D22: H2R.4 H4L.13 H5L.13 U6.14(3Y2)
SOCKET_D23: H2R.2 H4L.12 H5L.12 U6.13(3Y1)
SOCKET_D24: H2L.3 H4L.10 H5L.10 U6.12(2Y4)
SOCKET_D25: H2L.5 H4L.9 H5L.9 U6.11(2Y3)
SOCKET_D26: H2L.7 H4L.8 H5L.8 U6.9(2Y2)
SOCKET_D27: H2L.9 H4L.7 H5L.7 U6.8(2Y1)
SOCKET_D28: H2R.7 H4L.6 H5L.6 U6.6(1Y4)
SOCKET_D29: H2R.5 H4L.5 H5L.5 U6.5(1Y3)
SOCKET_D30: H2R.3 H4L.4 H5L.4 U6.3(1Y2)
SOCKET_D31: H2R.1 H4L.3 H5L.3 U1.51(PB12) U6.2(1Y1)
SOCKET_OE: H1L.12 H2L.1 H3L.20 H4L.20 H5L.20 H7L.20 Q1.1(G) Q3.1(G) R7.1 U1.23(PA0-WKUP) U5.1(1OE#) U5.24(4OE#) U5.25(3OE#) U5.48(2OE#) U6.1(1OE#) U6.24(4OE#) U6.25(3OE#) U6.48(2OE#)
SOCKET_V5: D2.2(+) H1R.20 H2R.9 H3R.1 H5R.1 R14.2
STM_BOOT0: H5.1 R6.1 U1.91(PB5) U1.94(BOOT0)
STM_NRST: H6.5 U1.14(NRST)
STM_SWCLK_TCK: H6.2 U1.76(PA14)
STM_SWDIO_TMS: H6.4 U1.72(PA13)
STM_SWO_TDO: H6.6 U1.89(PB3)
USB_CC1: R5.1 U1.67(PA8) USBC1.A5(CC1)
USB_CC2: R4.1 U1.69(PA10) USBC1.B5(CC2)
USB_DM: U1.70(PA11) USBC1.A7(DN1) USBC1.B7(DN2)
USB_DP: U1.71(PA12) USBC1.A6(DP1) USBC1.B6(DP2)
USB_V5: D1.2(+) U1.68(PA9) USBC1.A4B9(VBUS) USBC1.B4A9(VBUS)
Net-(LED1-2): LED1.2(+) R1.1
Net-(LED2-2): LED2.2(A) R2.1
Net-(LED3-1): LED3.1(-) R3.1
Net-(Q1-3): Q1.3(D) R1.2
Net-(Q2-1): Q2.1(G) Q3.3(D) R10.1 R13.2
Net-(U1-12): U1.12(OSC_IN) X1.2(OSC2)
Net-(U1-13): U1.13(OSC_OUT) X1.1(OSC1)

Not connected (* = marked no-connect by the designer): H1L 10*; H1R 10*; H3L 1* 2*; H4L 1* 2*; H5L 1* 2*; H5R 2*; H7L 1* 2*; U1 73(NC)* 77(PA15)*; U2 10(NC)* 13(NC)* 14(NC)*; U3 10(NC)* 13(NC)* 14(NC)*; USBC1 A8(SBU1)* B8(SBU2)*

## Notes on the sheets
sheet 1
- Amiga KickSmash 32 - In-system smart flash EEPROM
- Rev 7 2025-03-12
- IO
- IO
- IO
- IO
- IO
- IO
- IO
- O
- Program
- O
- I
- I
- and debug
- I
- I
- I
- O
- I
- I
- IO
- USB
- I
- IO
- I
- IO
- Type-C
- I
- I
- IO
- IO
- I
- IO
- IO
- IO
- I
- I
- I
- I
- I
- PA15=JTAG
- I
- I
- I
- I
- IO
- IO
- IO
- IO
- IO
- DFU
- I
- I
- I
- IO
- I
- I
- PB2=BOOT1
- O
- I
- I
- IO
- I
- IO
- IO
- IO
- IO
- IO
- IO
- IO
- IO
- IO
- IO
- IO
- IO
- IO
- IO
- IO
- IO
- Power
- IO
- I
- IO
- O
- IO
- I
- Capture Amiga reset
sheet 2
- Input Power
- Status LEDs
- P-Chan
- STM32 can override these
- If using Yellow or Green LED
  here, use 3.3K - 5.1K resistor.
sheet 3
- A3000 U182/U183
- AmigaPCI
- A3000/A4000
- ROM Tower
- AT27C4096
- Right Socket D0-D15
- Left Socket D16-D31
sheet 4
- Bus drivers are used to decouple STM32 putting response and
  flash write data on the bus from when the Amiga CPU does a read.
- When FLASH_OEWE is high, FLASH_WE will be
  driven low when SOCKET_OE is low. Otherwise,
  FLASH_WE is managed by the STM32. This will
  allow the Amiga CPU to terminate a flash command
  write at the end of a bus cycle.
- N-Chan
- N-Chan
